# EAGLE schematic M8350 (EAGLE 6.6.0)
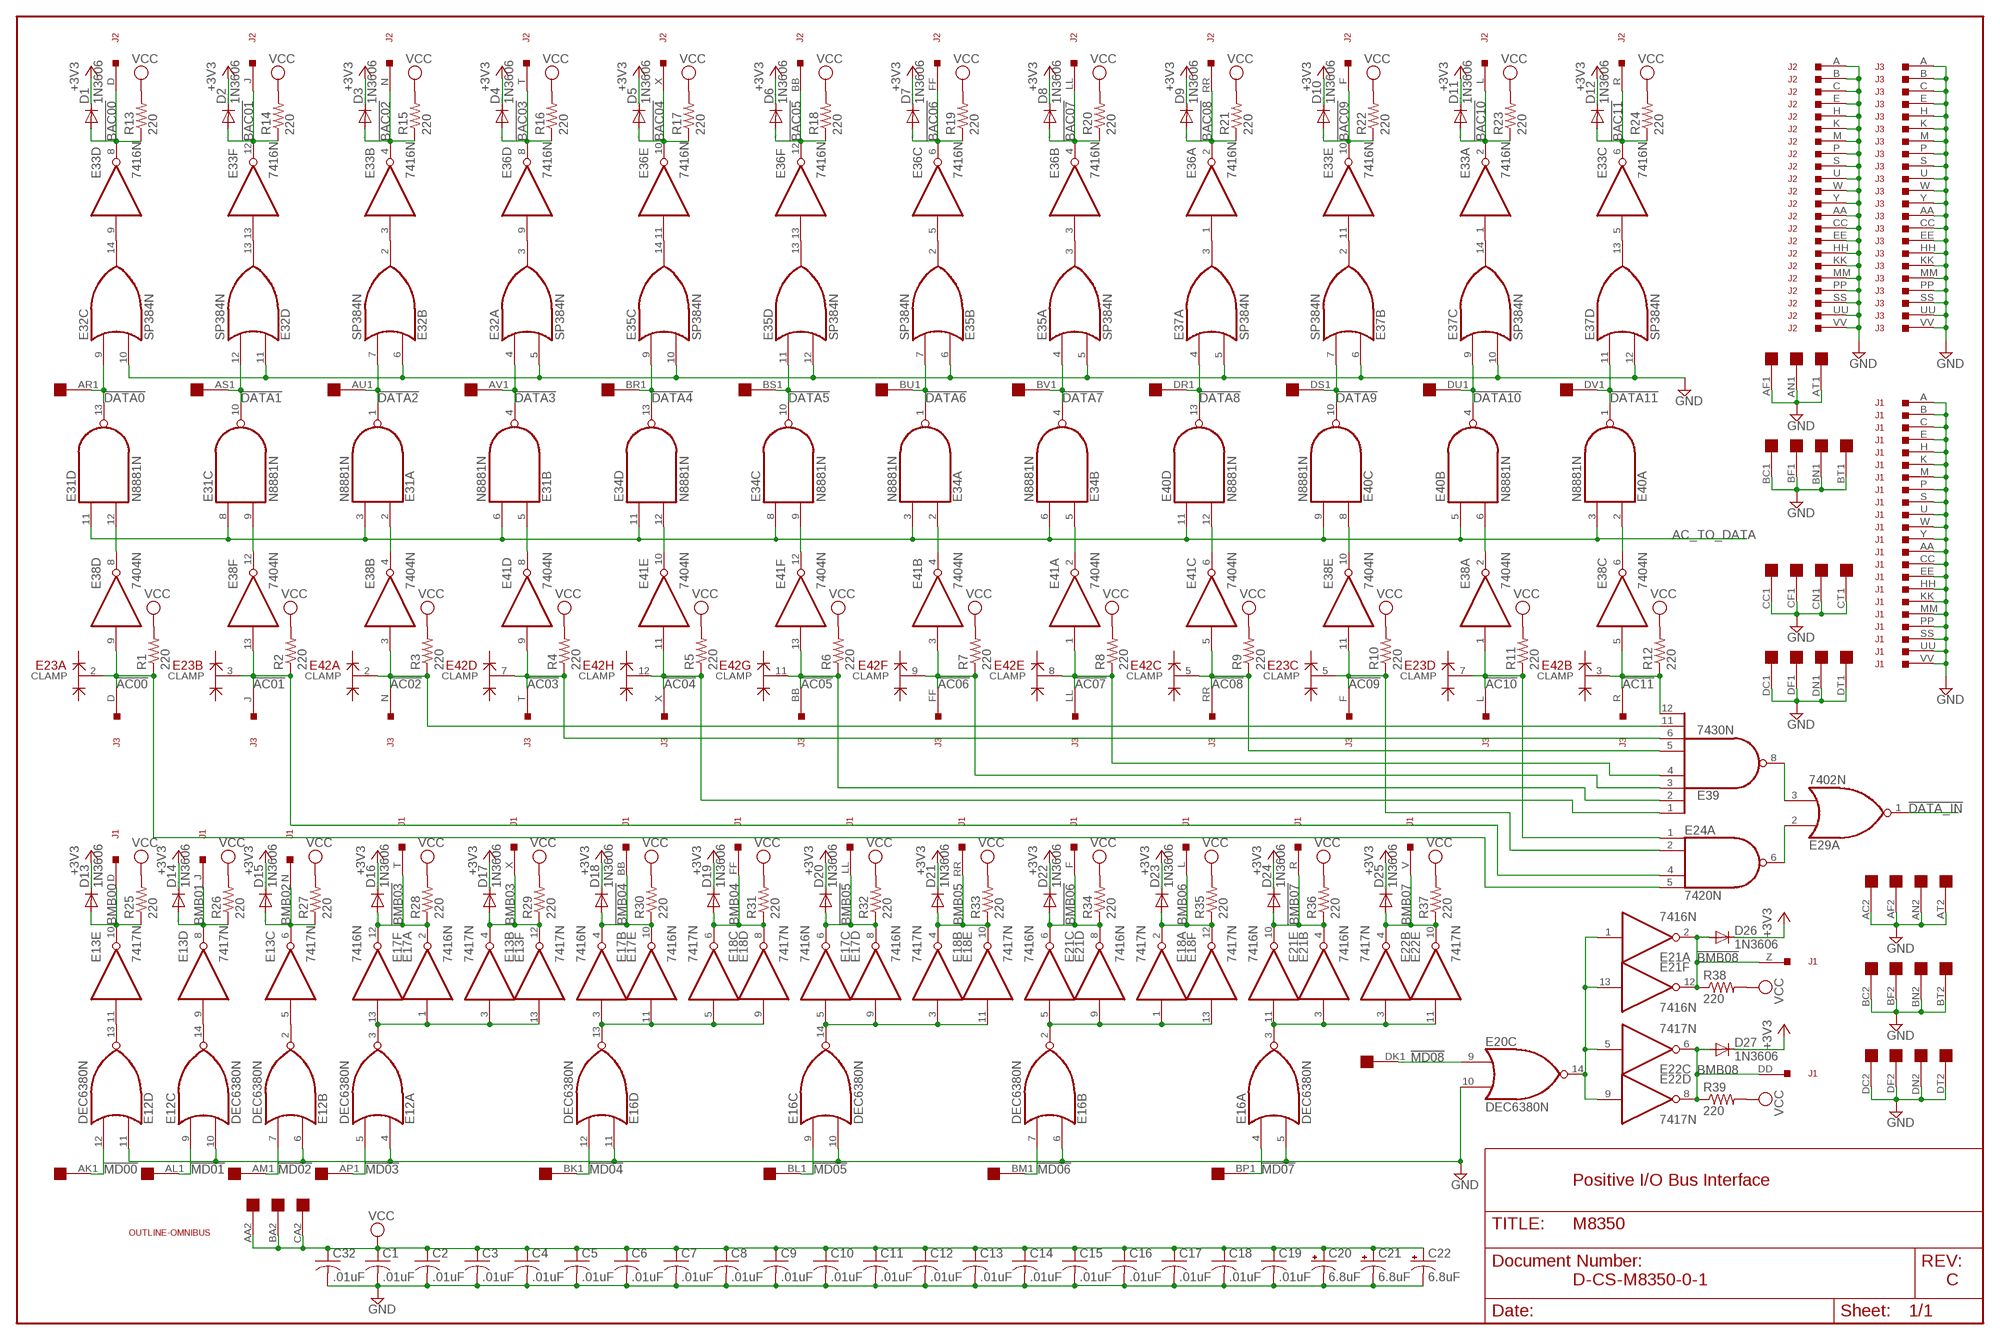
[diagram p0: schematic, sheet 1, part 1 of 2]
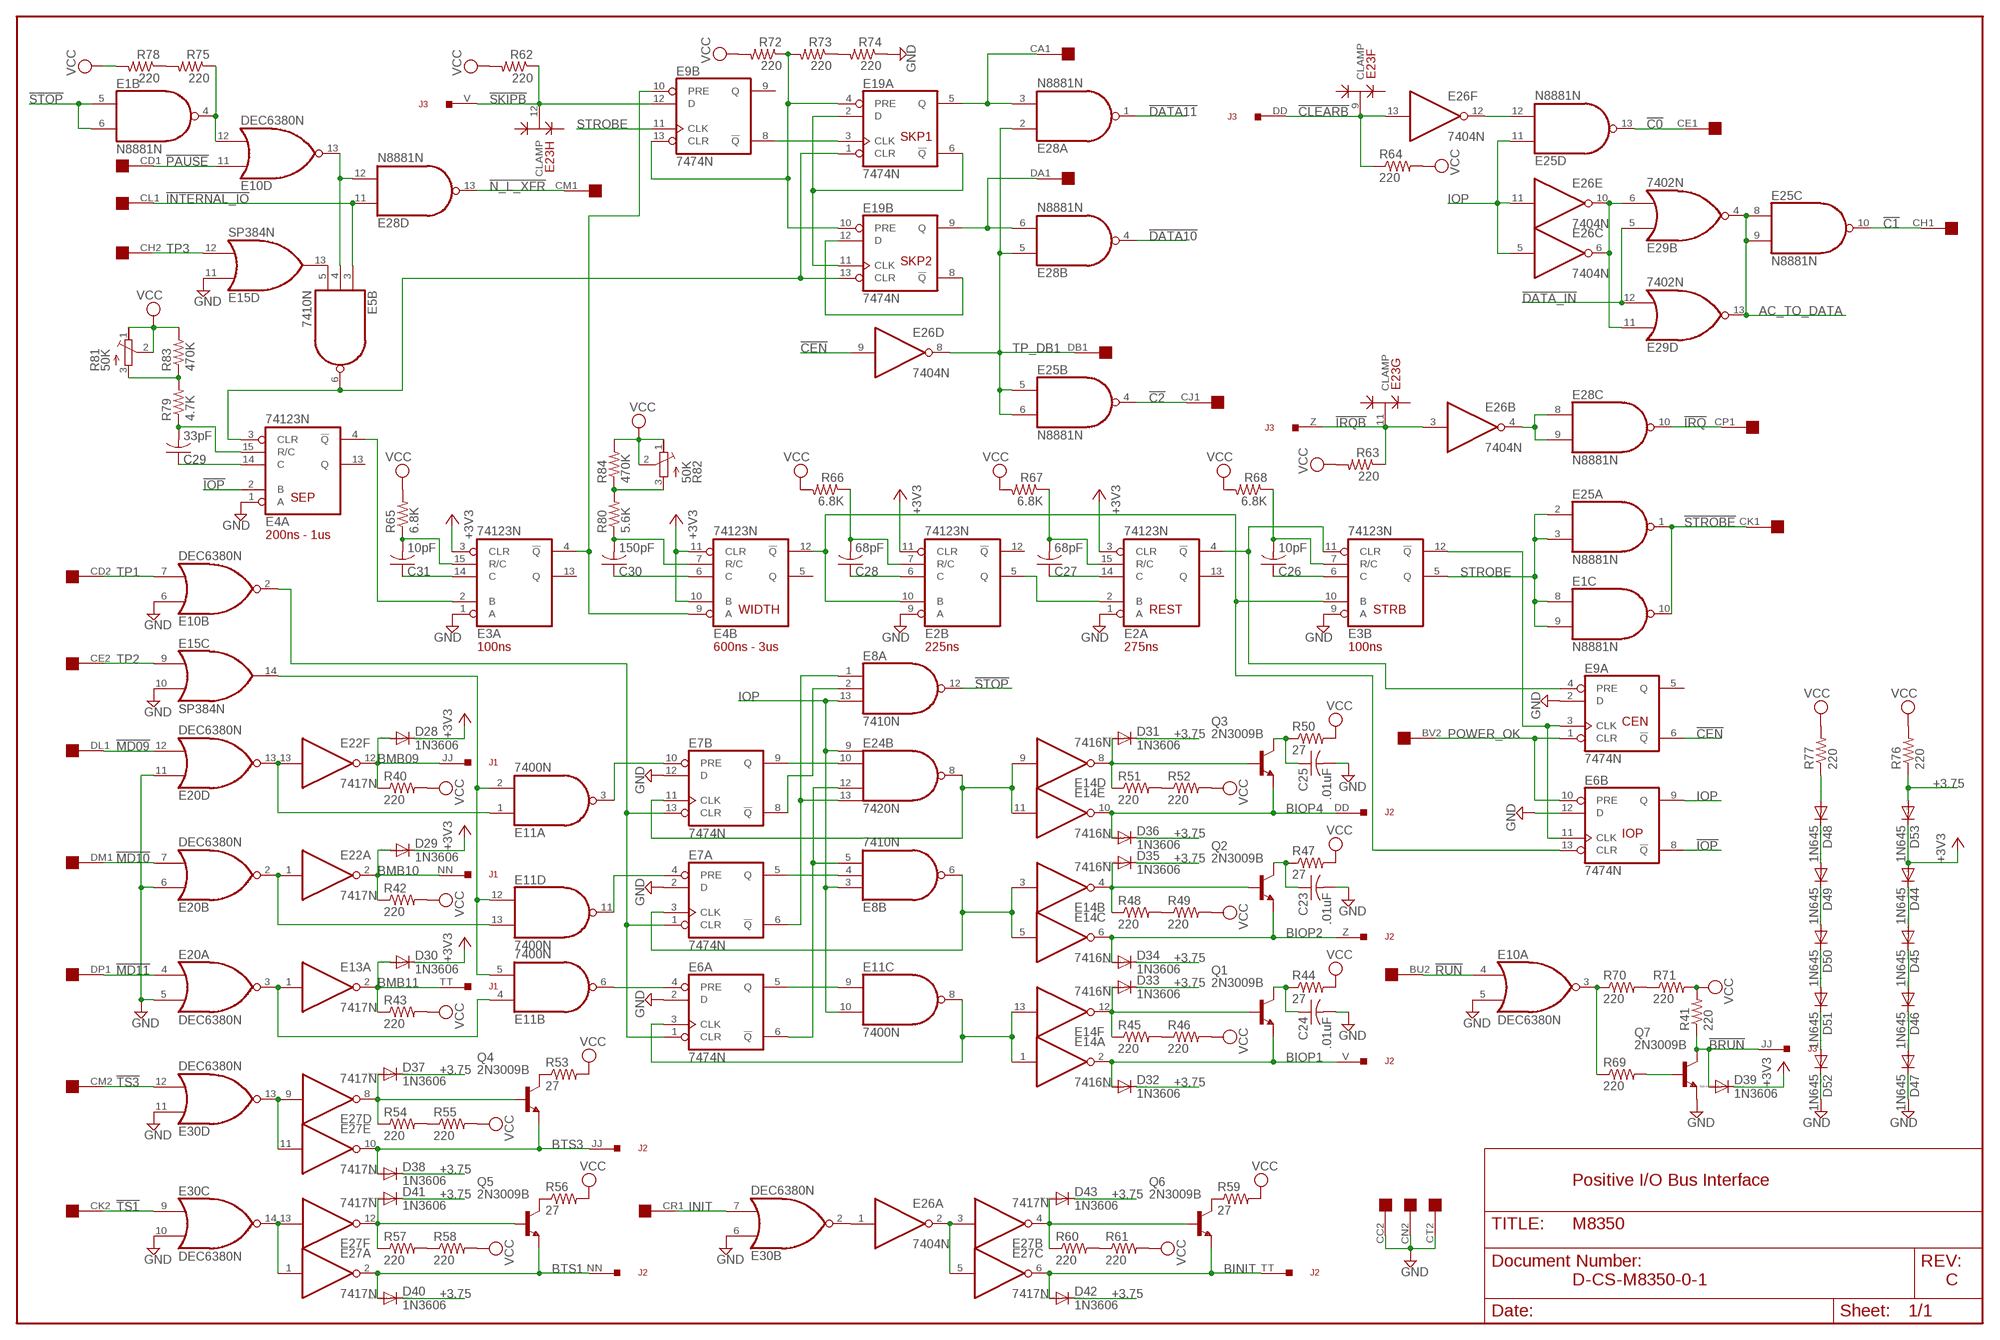
[diagram p1: schematic, sheet 1, part 2 of 2]

## Parts
C1  .01uF  C-US050-025X075  [C050-025X075]
C2  .01uF  C-US050-025X075  [C050-025X075]
C3  .01uF  C-US050-025X075  [C050-025X075]
C4  .01uF  C-US050-025X075  [C050-025X075]
C5  .01uF  C-US050-025X075  [C050-025X075]
C6  .01uF  C-US050-025X075  [C050-025X075]
C7  .01uF  C-US050-025X075  [C050-025X075]
C8  .01uF  C-US050-025X075  [C050-025X075]
C9  .01uF  C-US050-025X075  [C050-025X075]
C10  .01uF  C-US050-025X075  [C050-025X075]
C11  .01uF  C-US050-025X075  [C050-025X075]
C12  .01uF  C-US050-025X075  [C050-025X075]
C13  .01uF  C-US050-025X075  [C050-025X075]
C14  .01uF  C-US050-025X075  [C050-025X075]
C15  .01uF  C-US050-025X075  [C050-025X075]
C16  .01uF  C-US050-025X075  [C050-025X075]
C17  .01uF  C-US050-025X075  [C050-025X075]
C18  .01uF  C-US050-025X075  [C050-025X075]
C19  .01uF  C-US050-025X075  [C050-025X075]
C20  6.8uF  CPOL-USE20-8AXIAL  [E12-8]
C21  6.8uF  CPOL-USE20-8AXIAL  [E12-8]
C22  6.8uF  CPOL-USE20-8AXIAL  [E12-8]
C23  .01uF  C-US050-025X075  [C050-025X075]
C24  .01uF  C-US050-025X075  [C050-025X075]
C25  .01uF  C-US050-025X075  [C050-025X075]
C26  10pF  C-US050-025X075  [C050-025X075]
C27  68pF  C-US050-025X075  [C050-025X075]
C28  68pF  C-US050-025X075  [C050-025X075]
C29  33pF  C-US050-025X075  [C050-025X075]
C30  150pF  C-US050-025X075  [C050-025X075]
C31  10pF  C-US050-025X075  [C050-025X075]
C32  .01uF  C-US050-025X075  [C050-025X075]
D1  1N3606  DIODE-DO35-10  [DO35-10]
D2  1N3606  DIODE-DO35-10  [DO35-10]
D3  1N3606  DIODE-DO35-10  [DO35-10]
D4  1N3606  DIODE-DO35-10  [DO35-10]
D5  1N3606  DIODE-DO35-10  [DO35-10]
D6  1N3606  DIODE-DO35-10  [DO35-10]
D7  1N3606  DIODE-DO35-10  [DO35-10]
D8  1N3606  DIODE-DO35-10  [DO35-10]
D9  1N3606  DIODE-DO35-10  [DO35-10]
D10  1N3606  DIODE-DO35-10  [DO35-10]
D11  1N3606  DIODE-DO35-10  [DO35-10]
D12  1N3606  DIODE-DO35-10  [DO35-10]
D13  1N3606  DIODE-DO35-10  [DO35-10]
D14  1N3606  DIODE-DO35-10  [DO35-10]
D15  1N3606  DIODE-DO35-10  [DO35-10]
D16  1N3606  DIODE-DO35-10  [DO35-10]
D17  1N3606  DIODE-DO35-10  [DO35-10]
D18  1N3606  DIODE-DO35-10  [DO35-10]
D19  1N3606  DIODE-DO35-10  [DO35-10]
D20  1N3606  DIODE-DO35-10  [DO35-10]
D21  1N3606  DIODE-DO35-10  [DO35-10]
D22  1N3606  DIODE-DO35-10  [DO35-10]
D23  1N3606  DIODE-DO35-10  [DO35-10]
D24  1N3606  DIODE-DO35-10  [DO35-10]
D25  1N3606  DIODE-DO35-10  [DO35-10]
D26  1N3606  DIODE-DO35-10  [DO35-10]
D27  1N3606  DIODE-DO35-10  [DO35-10]
D28  1N3606  DIODE-DO35-10  [DO35-10]
D29  1N3606  DIODE-DO35-10  [DO35-10]
D30  1N3606  DIODE-DO35-10  [DO35-10]
D31  1N3606  DIODE-DO35-10  [DO35-10]
D32  1N3606  DIODE-DO35-10  [DO35-10]
D33  1N3606  DIODE-DO35-10  [DO35-10]
D34  1N3606  DIODE-DO35-10  [DO35-10]
D35  1N3606  DIODE-DO35-10  [DO35-10]
D36  1N3606  DIODE-DO35-10  [DO35-10]
D37  1N3606  DIODE-DO35-10  [DO35-10]
D38  1N3606  DIODE-DO35-10  [DO35-10]
D39  1N3606  DIODE-DO35-10  [DO35-10]
D40  1N3606  DIODE-DO35-10  [DO35-10]
D41  1N3606  DIODE-DO35-10  [DO35-10]
D42  1N3606  DIODE-DO35-10  [DO35-10]
D43  1N3606  DIODE-DO35-10  [DO35-10]
D44  1N645  DIODE-DO35-10  [DO35-10]
D45  1N645  DIODE-DO35-10  [DO35-10]
D46  1N645  DIODE-DO35-10  [DO35-10]
D47  1N645  DIODE-DO35-10  [DO35-10]
D48  1N645  DIODE-DO35-10  [DO35-10]
D49  1N645  DIODE-DO35-10  [DO35-10]
D50  1N645  DIODE-DO35-10  [DO35-10]
D51  1N645  DIODE-DO35-10  [DO35-10]
D52  1N645  DIODE-DO35-10  [DO35-10]
D53  1N645  DIODE-DO35-10  [DO35-10]
E1  N8881N  [DIL14]
E2  74123N  [DIL16]
E3  74123N  [DIL16]
E4  74123N  [DIL16]
E5  7410N  [DIL14]
E6  7474N  74S74N  [DIL14]
E7  7474N  74S74N  [DIL14]
E8  7410N  [DIL14]
E9  7474N  74S74N  [DIL14]
E10  DEC6380N  SP380N  [DIL14]
E11  7400N  [DIL14]
E12  DEC6380N  SP380N  [DIL14]
E13  7417N  [DIL14]
E14  7416N  [DIL14]
E15  SP384N  [DIL14]
E16  DEC6380N  SP380N  [DIL14]
E17  7416N  [DIL14]
E18  7417N  [DIL14]
E19  7474N  74S74N  [DIL14]
E20  DEC6380N  SP380N  [DIL14]
E21  7416N  [DIL14]
E22  7417N  [DIL14]
E23  DEC2501  [DIL14]
E24  7420N  74S20N  [DIL14]
E25  N8881N  [DIL14]
E26  7404N  [DIL14]
E27  7417N  [DIL14]
E28  N8881N  [DIL14]
E29  7402N  [DIL14]
E30  DEC6380N  SP380N  [DIL14]
E31  N8881N  [DIL14]
E32  SP384N  [DIL14]
E33  7416N  [DIL14]
E34  N8881N  [DIL14]
E35  SP384N  [DIL14]
E36  7416N  [DIL14]
E37  SP384N  [DIL14]
E38  7404N  [DIL14]
E39  7430N  [DIL14]
E40  N8881N  [DIL14]
E41  7404N  [DIL14]
E42  DEC2501  [DIL14]
J1  DEC40PINSH  [DEC40PINH]
J2  DEC40PINSH  [DEC40PINH]
J3  DEC40PINSH  [DEC40PINH]
Q1  2N3009B  -NPN-TO5  [TO5]
Q2  2N3009B  -NPN-TO5  [TO5]
Q3  2N3009B  -NPN-TO5  [TO5]
Q4  2N3009B  -NPN-TO5  [TO5]
Q5  2N3009B  -NPN-TO5  [TO5]
Q6  2N3009B  -NPN-TO5  [TO5]
Q7  2N3009B  -NPN-TO5  [TO5]
R1  220  R-US_0207/10  [0207/10]
R2  220  R-US_0207/10  [0207/10]
R3  220  R-US_0207/10  [0207/10]
R4  220  R-US_0207/10  [0207/10]
R5  220  R-US_0207/10  [0207/10]
R6  220  R-US_0207/10  [0207/10]
R7  220  R-US_0207/10  [0207/10]
R8  220  R-US_0207/10  [0207/10]
R9  220  R-US_0207/10  [0207/10]
R10  220  R-US_0207/10  [0207/10]
R11  220  R-US_0207/10  [0207/10]
R12  220  R-US_0207/10  [0207/10]
R13  220  R-US_0207/10  [0207/10]
R14  220  R-US_0207/10  [0207/10]
R15  220  R-US_0207/10  [0207/10]
R16  220  R-US_0207/10  [0207/10]
R17  220  R-US_0207/10  [0207/10]
R18  220  R-US_0207/10  [0207/10]
R19  220  R-US_0207/10  [0207/10]
R20  220  R-US_0207/10  [0207/10]
R21  220  R-US_0207/10  [0207/10]
R22  220  R-US_0207/10  [0207/10]
R23  220  R-US_0207/10  [0207/10]
R24  220  R-US_0207/10  [0207/10]
R25  220  R-US_0207/10  [0207/10]
R26  220  R-US_0207/10  [0207/10]
R27  220  R-US_0207/10  [0207/10]
R28  220  R-US_0207/10  [0207/10]
R29  220  R-US_0207/10  [0207/10]
R30  220  R-US_0207/10  [0207/10]
R31  220  R-US_0207/10  [0207/10]
R32  220  R-US_0207/10  [0207/10]
R33  220  R-US_0207/10  [0207/10]
R34  220  R-US_0207/10  [0207/10]
R35  220  R-US_0207/10  [0207/10]
R36  220  R-US_0207/10  [0207/10]
R37  220  R-US_0207/10  [0207/10]
R38  220  R-US_0207/10  [0207/10]
R39  220  R-US_0207/10  [0207/10]
R40  220  R-US_0207/10  [0207/10]
R41  220  R-US_0207/10  [0207/10]
R42  220  R-US_0207/10  [0207/10]
R43  220  R-US_0207/10  [0207/10]
R44  27  R-US_0207/10  [0207/10]
R45  220  R-US_0207/10  [0207/10]
R46  220  R-US_0207/10  [0207/10]
R47  27  R-US_0207/10  [0207/10]
R48  220  R-US_0207/10  [0207/10]
R49  220  R-US_0207/10  [0207/10]
R50  27  R-US_0207/10  [0207/10]
R51  220  R-US_0207/10  [0207/10]
R52  220  R-US_0207/10  [0207/10]
R53  27  R-US_0207/10  [0207/10]
R54  220  R-US_0207/10  [0207/10]
R55  220  R-US_0207/10  [0207/10]
R56  27  R-US_0207/10  [0207/10]
R57  220  R-US_0207/10  [0207/10]
R58  220  R-US_0207/10  [0207/10]
R59  27  R-US_0207/10  [0207/10]
R60  220  R-US_0207/10  [0207/10]
R61  220  R-US_0207/10  [0207/10]
R62  220  R-US_0207/10  [0207/10]
R63  220  R-US_0207/10  [0207/10]
R64  220  R-US_0207/10  [0207/10]
R65  6.8K  R-US_0207/10  [0207/10]
R66  6.8K  R-US_0207/10  [0207/10]
R67  6.8K  R-US_0207/10  [0207/10]
R68  6.8K  R-US_0207/10  [0207/10]
R69  220  R-US_0207/10  [0207/10]
R70  220  R-US_0207/10  [0207/10]
R71  220  R-US_0207/10  [0207/10]
R72  220  R-US_0207/10  [0207/10]
R73  220  R-US_0207/10  [0207/10]
R74  220  R-US_0207/10  [0207/10]
R75  220  R-US_0207/10  [0207/10]
R76  220  R-US_0207/10  [0207/10]
R77  220  R-US_0207/10  [0207/10]
R78  220  R-US_0207/10  [0207/10]
R79  4.7K  R-US_0207/10  [0207/10]
R80  5.6K  R-US_0207/10  [0207/10]
R81  50K  275P  [3006Y]
R82  50K  275P  [3006Y]
R83  470K  R-US_0207/10  [0207/10]
R84  470K  R-US_0207/10  [0207/10]
U$1  OUTLINE-OMNIBUS  [OMNIBUS]
U$2  QUAD  [EDGE-CON8]

## Nets
!AC00: E23.2(A:CLAMP) E24.5(A:I3) E38.9(D:I) J3.D R1.1
!AC01: E23.3(B:CLAMP) E24.4(A:I2) E38.13(F:I) J3.J R2.1
!AC02: E38.3(B:I) E39.11(I6) E42.2(A:CLAMP) J3.N R3.1
!AC03: E39.6(I5) E41.9(D:I) E42.7(D:CLAMP) J3.T R4.1
!AC04: E39.1(I0) E41.11(E:I) E42.12(H:CLAMP) J3.X R5.1
!AC05: E39.2(I1) E41.13(F:I) E42.11(G:CLAMP) J3.BB R6.1
!AC06: E39.3(I2) E41.3(B:I) E42.9(F:CLAMP) J3.FF R7.1
!AC07: E39.4(I3) E41.1(A:I) E42.8(E:CLAMP) J3.LL R8.1
!AC08: E39.5(I4) E41.5(C:I) E42.5(C:CLAMP) J3.RR R9.1
!AC09: E23.5(C:CLAMP) E24.2(A:I1) E38.11(E:I) J3.F R10.1
!AC10: E23.7(D:CLAMP) E24.1(A:I0) E38.1(A:I) J3.L R11.1
!AC11: E38.5(C:I) E39.12(I7) E42.3(B:CLAMP) J3.R R12.1
!BAC00: D1.A E33.8(D:O) J2.D R13.1
!BAC01: D2.A E33.12(F:O) J2.J R14.1
!BAC02: D3.A E33.4(B:O) J2.N R15.1
!BAC03: D4.A E36.8(D:O) J2.T R16.1
!BAC04: D5.A E36.10(E:O) J2.X R17.1
!BAC05: D6.A E36.12(F:O) J2.BB R18.1
!BAC06: D7.A E36.6(C:O) J2.FF R19.1
!BAC07: D8.A E36.4(B:O) J2.LL R20.1
!BAC08: D9.A E36.2(A:O) J2.RR R21.1
!BAC09: D10.A E33.10(E:O) J2.F R22.1
!BAC10: D11.A E33.2(A:O) J2.L R23.1
!BAC11: D12.A E33.6(C:O) J2.R R24.1
!BMB03: D16.A E17.2(A:O) E17.12(F:O) J1.T R28.1
!BMB04: D18.A E17.4(B:O) E17.10(E:O) J1.BB R30.1
!BMB05: D20.A E17.6(C:O) E17.8(D:O) J1.LL R32.1
!BMB06: D22.A E21.6(C:O) E21.8(D:O) J1.F R34.1
!BMB07: D24.A E21.4(B:O) E21.10(E:O) J1.R R36.1
!BMB08: D26.A E21.2(A:O) E21.12(F:O) J1.Z R38.1
!BRUN: D39.A J3.JJ Q7.3(C) R41.1
!C0: E25.13(D:O) U$2.CE1
!C1: E25.10(C:O) U$2.CH1
!C2: E25.4(B:O) U$2.CJ1
!CEN: E9.6(A:!Q) E26.9(D:I)
!CLEARB: E23.9(F:CLAMP) E26.13(F:I) J3.DD R64.1
!DATA0: E31.13(D:O) E32.9(C:I0) U$2.AR1
!DATA1: E31.10(C:O) E32.12(D:I1) U$2.AS1
!DATA2: E31.1(A:O) E32.7(B:I1) U$2.AU1
!DATA3: E31.4(B:O) E32.4(A:I0) U$2.AV1
!DATA4: E34.13(D:O) E35.9(C:I0) U$2.BR1
!DATA5: E34.10(C:O) E35.11(D:I0) U$2.BS1
!DATA6: E34.1(A:O) E35.7(B:I1) U$2.BU1
!DATA7: E34.4(B:O) E35.4(A:I0) U$2.BV1
!DATA8: E37.4(A:I0) E40.13(D:O) U$2.DR1
!DATA9: E37.7(B:I1) E40.10(C:O) U$2.DS1
!DATA10: E28.4(B:O) E37.9(C:I0) E40.4(B:O) U$2.DU1
!DATA11: E28.1(A:O) E37.11(D:I0) E40.1(A:O) U$2.DV1
!DATA_IN: E29.1(A:O) E29.5(B:I0) E29.12(D:I1)
!INTERNAL_IO: E5.3(B:I0) E28.11(D:I0) U$2.CL1
!IOP: E4.2(A:B) E6.8(B:!Q)
!IRQ: E28.10(C:O) U$2.CP1
!IRQB: E23.11(G:CLAMP) E26.3(B:I) J3.Z R63.1
!MD00: E12.12(D:I1) U$2.AK1
!MD01: E12.9(C:I0) U$2.AL1
!MD02: E12.7(B:I1) U$2.AM1
!MD03: E12.5(A:I1) U$2.AP1
!MD04: E16.12(D:I1) U$2.BK1
!MD05: E16.9(C:I0) U$2.BL1
!MD06: E16.7(B:I1) U$2.BM1
!MD07: E16.4(A:I0) U$2.BP1
!MD08: E20.9(C:I0) U$2.DK1
!MD09: E20.12(D:I1) U$2.DL1
!MD10: E20.7(B:I1) U$2.DM1
!MD11: E20.4(A:I0) U$2.DP1
!N_L_XFR: E28.13(D:O) U$2.CM1
!PAUSE: E10.11(D:I0) U$2.CD1
!RUN: E10.4(A:I0) U$2.BU2
!SKIPB: E9.12(B:D) E23.12(H:CLAMP) J3.V R62.1
!STOP: E1.5(B:I0) E1.6(B:I1) E8.12(A:O)
!STROBE: E1.10(C:O) E25.1(A:O) U$2.CK1
!TS1: E30.9(C:I0) U$2.CK2
!TS3: E30.12(D:I1) U$2.CM2
+3.75: D31.C D32.C D33.C D34.C D35.C D36.C D37.C D38.C D40.C D41.C D42.C D43.C D53.A R76.1
+3V3: D1.C D2.C D3.C D4.C D5.C D6.C D7.C D8.C D9.C D10.C D11.C D12.C D13.C D14.C D15.C D16.C D17.C D18.C D19.C D20.C D21.C D22.C D23.C D24.C D25.C D26.C D27.C D28.C D29.C D30.C D39.C D44.A D53.C E2.3(A:CLR) E2.11(B:CLR) E3.3(A:CLR) E4.10(B:B) E4.11(B:CLR)
AC_TO_DATA: E25.8(C:I0) E25.9(C:I1) E29.4(B:O) E29.13(D:O) E31.3(A:I1) E31.6(B:I1) E31.8(C:I0) E31.11(D:I0) E34.3(A:I1) E34.6(B:I1) E34.8(C:I0) E34.11(D:I0) E40.3(A:I1) E40.5(B:I0) E40.9(C:I1) E40.11(D:I0)
BINIT: D42.A E27.6(C:O) J2.TT Q6.1(E)
BIOP1: D32.A E14.2(A:O) J2.V Q1.1(E)
BIOP2: D34.A E14.6(C:O) J2.Z Q2.1(E)
BIOP4: D36.A E14.10(E:O) J2.DD Q3.1(E)
BMB00: D13.A E13.10(E:O) J1.D R25.1
BMB01: D14.A E13.8(D:O) J1.J R26.1
BMB02: D15.A E13.6(C:O) J1.N R27.1
BMB03: D17.A E13.4(B:O) E13.12(F:O) J1.X R29.1
BMB04: D19.A E18.6(C:O) E18.8(D:O) J1.FF R31.1
BMB05: D21.A E18.4(B:O) E18.10(E:O) J1.RR R33.1
BMB06: D23.A E18.2(A:O) E18.12(F:O) J1.L R35.1
BMB07: D25.A E22.4(B:O) E22.10(E:O) J1.V R37.1
BMB08: D27.A E22.6(C:O) E22.8(D:O) J1.DD R39.1
BMB09: D28.A E22.12(F:O) J1.JJ R40.1
BMB10: D29.A E22.2(A:O) J1.NN R42.1
BMB11: D30.A E13.2(A:O) J1.TT R43.1
BTS1: D40.A E27.2(A:O) J2.NN Q5.1(E)
BTS3: D38.A E27.10(E:O) J2.JJ Q4.1(E)
GND: C1.2 C2.2 C3.2 C4.2 C5.2 C6.2 C7.2 C8.2 C9.2 C10.2 C11.2 C12.2 C13.2 C14.2 C15.2 C16.2 C17.2 C18.2 C19.2 C20.- C21.- C22.- C23.2 C24.2 C25.2 C32.2 D47.C D52.C E2.1(A:A) E2.9(B:A) E3.1(A:A) E3.9(B:A) E4.1(A:A) E6.2(A:D) E6.12(B:D) E7.2(A:D) E7.12(B:D) E9.2(A:D) E10.5(A:I1) E10.6(B:I0) E12.4(A:I0) E12.6(B:I0) E12.10(C:I1) E12.11(D:I0) E15.10(C:I1) E15.11(D:I0) E16.5(A:I1) E16.6(B:I0) E16.10(C:I1) E16.11(D:I0) E20.5(A:I1) E20.6(B:I0) E20.10(C:I1) E20.11(D:I0) E30.6(B:I0) E30.10(C:I1) E30.11(D:I0) E32.5(A:I1) E32.6(B:I0) E32.10(C:I1) E32.11(D:I0) E35.5(A:I1) E35.6(B:I0) E35.10(C:I1) E35.12(D:I1) E37.5(A:I1) E37.6(B:I0) E37.10(C:I1) E37.12(D:I1) J1.A J1.AA J1.B J1.C J1.CC J1.E J1.EE J1.H J1.HH J1.K J1.KK J1.M J1.MM J1.P J1.PP J1.S J1.SS J1.U J1.UU J1.VV J1.W J1.Y J2.A J2.AA J2.B J2.C J2.CC J2.E J2.EE J2.H J2.HH J2.K J2.KK J2.M J2.MM J2.P J2.PP J2.S J2.SS J2.U J2.UU J2.VV J2.W J2.Y J3.A J3.AA J3.B J3.C J3.CC J3.E J3.EE J3.H J3.HH J3.K J3.KK J3.M J3.MM J3.P J3.PP J3.S J3.SS J3.U J3.UU J3.VV J3.W J3.Y Q7.1(E) R74.1 U$2.AC2 U$2.AF1 U$2.AF2 U$2.AN1 U$2.AN2 U$2.AT1 U$2.AT2 U$2.BC1 U$2.BC2 U$2.BF1 U$2.BF2 U$2.BN1 U$2.BN2 U$2.BT1 U$2.BT2 U$2.CC1 U$2.CC2 U$2.CF1 U$2.CN1 U$2.CN2 U$2.CT1 U$2.CT2 U$2.DC1 U$2.DC2 U$2.DF1 U$2.DF2 U$2.DN1 U$2.DN2 U$2.DT1 U$2.DT2
INIT: E30.7(B:I1) U$2.CR1
IOP: E6.9(B:Q) E8.3(B:I0) E8.13(A:I2) E11.10(C:I1) E24.9(B:I0) E25.11(D:I0) E26.5(C:I) E26.11(E:I)
N$1: E32.14(C:O) E33.9(D:I)
N$2: E31.2(A:I0) E38.4(B:O)
N$3: E34.12(D:I1) E41.10(E:O)
N$4: E31.12(D:I1) E38.8(D:O)
N$5: E31.9(C:I1) E38.12(F:O)
N$6: E16.13(D:O) E17.3(B:I) E17.11(E:I) E18.5(C:I) E18.9(D:I)
N$8: E34.9(C:I1) E41.12(F:O)
N$9: E34.2(A:I0) E41.4(B:O)
N$10: E34.5(B:I0) E41.2(A:O)
N$11: E40.12(D:I1) E41.6(C:O)
N$12: E38.6(C:O) E40.2(A:I0)
N$13: E38.10(E:O) E40.8(C:I0)
N$14: E38.2(A:O) E40.6(B:I1)
N$15: E24.6(A:O) E29.2(A:I0)
N$16: E29.3(A:I1) E39.8(O)
N$17: E32.2(B:O) E33.3(B:I)
N$18: E32.13(D:O) E33.13(F:I)
N$19: E31.5(B:I0) E41.8(D:O)
N$20: E32.3(A:O) E36.9(D:I)
N$21: E35.14(C:O) E36.11(E:I)
N$22: E35.13(D:O) E36.13(F:I)
N$23: E35.2(B:O) E36.5(C:I)
N$24: E35.3(A:O) E36.3(B:I)
N$25: E36.1(A:I) E37.3(A:O)
N$26: E33.11(E:I) E37.2(B:O)
N$27: E33.1(A:I) E37.14(C:O)
N$28: E33.5(C:I) E37.13(D:O)
N$40: E12.13(D:O) E13.11(E:I)
N$41: E16.14(C:O) E17.5(C:I) E17.9(D:I) E18.3(B:I) E18.11(E:I)
N$43: E16.3(A:O) E21.3(B:I) E21.11(E:I) E22.3(B:I) E22.11(E:I)
N$44: E20.14(C:O) E21.1(A:I) E21.13(F:I) E22.5(C:I) E22.9(D:I)
N$45: E12.14(C:O) E13.9(D:I)
N$46: E16.2(B:O) E18.1(A:I) E18.13(F:I) E21.5(C:I) E21.9(D:I)
N$47: E11.4(B:I0) E13.1(A:I) E20.3(A:O)
N$48: E11.1(A:I0) E20.13(D:O) E22.13(F:I)
N$49: E12.2(B:O) E13.5(C:I)
N$50: E12.3(A:O) E13.3(B:I) E13.13(F:I) E17.1(A:I) E17.13(F:I)
N$51: E11.13(D:I1) E20.2(B:O) E22.1(A:I)
N$52: R54.2 R55.1
N$53: E3.2(A:B) E4.4(A:!Q)
N$54: E27.9(D:I) E27.11(E:I) E30.13(D:O)
N$55: D37.A E27.8(D:O) Q4.2(B) R54.1
N$56: Q4.3(C) R53.1
N$57: E3.4(A:!Q) E4.9(B:A) E9.10(B:PRE)
N$58: D41.A E27.12(F:O) Q5.2(B) R57.1
N$59: E2.10(B:B) E3.10(B:B) E4.12(B:!Q) E6.13(B:CLR)
N$60: E27.1(A:I) E27.13(F:I) E30.14(C:O)
N$61: R57.2 R58.1
N$62: E2.2(A:B) E2.5(B:Q)
N$63: Q5.3(C) R56.1
N$64: E2.4(A:!Q) E3.11(B:CLR) E9.4(A:PRE)
N$65: E26.1(A:I) E30.2(B:O)
N$66: E26.2(A:O) E27.3(B:I) E27.5(C:I)
N$67: R60.2 R61.1
N$68: D43.A E27.4(B:O) Q6.2(B) R60.1
N$69: Q6.3(C) R59.1
N$70: R80.2 R82.3(E) R84.1
N$71: C29.2 E4.15(A:R/C) R79.1
N$72: C29.1 E4.14(A:C)
N$73: E11.2(A:I1) E11.5(B:I1) E11.12(D:I0) E15.14(C:O)
N$74: R79.2 R81.3(E) R83.1
N$75: C31.1 E3.14(A:C)
N$76: C31.2 E3.15(A:R/C) R65.1
N$77: C30.1 E4.6(B:C)
N$78: C30.2 E4.7(B:R/C) R80.1
N$79: C28.1 E2.6(B:C)
N$80: C28.2 E2.7(B:R/C) R66.1
N$81: C27.1 E2.14(A:C)
N$82: C27.2 E2.15(A:R/C) R67.1
N$83: C26.1 E3.6(B:C)
N$84: C26.2 E3.7(B:R/C) R68.1
N$85: E7.10(B:PRE) E11.3(A:O)
N$86: E7.4(A:PRE) E11.11(D:O)
N$87: E6.4(A:PRE) E11.6(B:O)
N$88: E6.1(A:CLR) E7.1(A:CLR) E7.13(B:CLR) E10.2(B:O)
N$89: E6.5(A:Q) E11.9(C:I0)
N$90: E7.5(A:Q) E8.4(B:I1)
N$92: E7.9(B:Q) E24.10(B:I1)
N$93: E6.6(A:!Q) E8.5(B:I2) E24.12(B:I2)
N$94: E7.6(A:!Q) E8.1(A:I0) E24.13(B:I3)
N$95: E7.8(B:!Q) E8.2(A:I1)
N$96: E7.3(A:CLK) E8.6(B:O) E14.3(B:I) E14.5(C:I)
N$97: E6.3(A:CLK) E11.8(C:O) E14.1(A:I) E14.13(F:I)
N$98: E7.11(B:CLK) E14.9(D:I) E14.11(E:I) E24.8(B:O)
N$99: D48.A R77.1
N$100: D44.C D45.A
N$101: D45.C D46.A
N$102: D46.C D47.A
N$104: D48.C D49.A
N$105: D51.C D52.A
N$106: D50.C D51.A
N$107: D49.C D50.A
N$108: D35.A E14.4(B:O) Q2.2(B) R48.1
N$109: D33.A E14.12(F:O) Q1.2(B) R45.1
N$110: R48.2 R49.1
N$111: R51.2 R52.1
N$112: D31.A E14.8(D:O) Q3.2(B) R51.1
N$113: C25.1 Q3.3(C) R50.1
N$114: E10.3(A:O) R69.1 R70.1
N$115: R70.2 R71.1
N$116: C23.1 Q2.3(C) R47.1
N$117: Q7.2(B) R69.2
N$118: C24.1 Q1.3(C) R44.1
N$119: R45.2 R46.1
N$120: R73.1 R74.2
N$121: E9.13(B:CLR) E19.4(A:PRE) E19.10(B:PRE) R72.1 R73.2
N$122: R75.2 R78.1
N$123: E26.6(C:O) E26.10(E:O) E29.6(B:I1) E29.11(D:I0)
N$126: E25.12(D:I1) E26.12(F:O)
N$128: E26.4(B:O) E28.8(C:I0) E28.9(C:I1)
N$130: E5.5(B:I2) E15.13(D:O)
N$131: E5.4(B:I1) E10.13(D:O) E28.12(D:I1)
N$134: E4.3(A:CLR) E5.6(B:O) E19.1(A:CLR) E19.13(B:CLR)
N$135: E19.2(A:D) E19.6(A:!Q) E19.11(B:CLK)
N$136: E1.4(B:O) E10.12(D:I1) R75.1
N$138: E9.8(B:!Q) E19.3(A:CLK)
N$140: E19.8(B:!Q) E19.12(B:D)
N$141: E3.12(B:!Q) E6.11(B:CLK) E9.3(A:CLK)
POWER_OK: E6.10(B:PRE) E9.1(A:CLR) U$2.BV2
SKP1: E19.5(A:Q) E28.3(A:I1) U$2.CA1
SKP2: E19.9(B:Q) E28.6(B:I1) U$2.DA1
STROBE: E1.8(C:I0) E1.9(C:I1) E3.5(B:Q) E9.11(B:CLK) E25.2(A:I0) E25.3(A:I1)
TP1: E10.7(B:I1) U$2.CD2
TP2: E15.9(C:I0) U$2.CE2
TP3: E15.12(D:I1) U$2.CH2
TP_DB1: E25.5(B:I0) E25.6(B:I1) E26.8(D:O) E28.2(A:I0) E28.5(B:I0) U$2.DB1
VCC: C1.1 C2.1 C3.1 C4.1 C5.1 C6.1 C7.1 C8.1 C9.1 C10.1 C11.1 C12.1 C13.1 C14.1 C15.1 C16.1 C17.1 C18.1 C19.1 C20.+ C21.+ C22.+ C32.1 R1.2 R2.2 R3.2 R4.2 R5.2 R6.2 R7.2 R8.2 R9.2 R10.2 R11.2 R12.2 R13.2 R14.2 R15.2 R16.2 R17.2 R18.2 R19.2 R20.2 R21.2 R22.2 R23.2 R24.2 R25.2 R26.2 R27.2 R28.2 R29.2 R30.2 R31.2 R32.2 R33.2 R34.2 R35.2 R36.2 R37.2 R38.2 R39.2 R40.2 R41.2 R42.2 R43.2 R44.2 R46.2 R47.2 R49.2 R50.2 R52.2 R53.2 R55.2 R56.2 R58.2 R59.2 R61.2 R62.2 R63.2 R64.2 R65.2 R66.2 R67.2 R68.2 R71.2 R72.2 R76.2 R77.2 R78.2 R81.1(A) R81.2(S) R82.1(A) R82.2(S) R83.2 R84.2 U$2.AA2 U$2.BA2 U$2.CA2
Unconnected: E1.1(A:O) E1.2(A:I0) E1.3(A:I1) E1.11(D:I0) E1.12(D:I1) E1.13(D:O) E2.12(B:!Q) E2.13(A:Q) E3.13(A:Q) E4.5(B:Q) E4.13(A:Q) E5.1(A:I0) E5.2(A:I1) E5.8(C:O) E5.9(C:I0) E5.10(C:I1) E5.11(C:I2) E5.12(A:O) E5.13(A:I2) E8.8(C:O) E8.9(C:I0) E8.10(C:I1) E8.11(C:I2) E9.5(A:Q) E9.9(B:Q) E10.9(C:I0) E10.10(C:I1) E10.14(C:O) E15.2(B:O) E15.3(A:O) E15.4(A:I0) E15.5(A:I1) E15.6(B:I0) E15.7(B:I1) E23.8(E:CLAMP) E29.8(C:I0) E29.9(C:I1) E29.10(C:O) E30.3(A:O) E30.4(A:I0) E30.5(A:I1) J3.NN J3.TT U$2.AA1 U$2.AB1 U$2.AB2 U$2.AC1 U$2.AD1 U$2.AD2 U$2.AE1 U$2.AE2 U$2.AH1 U$2.AH2 U$2.AJ1 U$2.AJ2 U$2.AK2 U$2.AL2 U$2.AM2 U$2.AP2 U$2.AR2 U$2.AS2 U$2.AU2 U$2.AV2 U$2.BA1 U$2.BB1 U$2.BB2 U$2.BD1 U$2.BD2 U$2.BE1 U$2.BE2 U$2.BH1 U$2.BH2 U$2.BJ1 U$2.BJ2 U$2.BK2 U$2.BL2 U$2.BM2 U$2.BP2 U$2.BR2 U$2.BS2 U$2.CB1 U$2.CB2 U$2.CF2 U$2.CJ2 U$2.CL2 U$2.CP2 U$2.CR2 U$2.CS1 U$2.CS2 U$2.CU1 U$2.CU2 U$2.CV1 U$2.CV2 U$2.DA2 U$2.DB2 U$2.DD1 U$2.DD2 U$2.DE1 U$2.DE2 U$2.DH1 U$2.DH2 U$2.DJ1 U$2.DJ2 U$2.DK2 U$2.DL2 U$2.DM2 U$2.DP2 U$2.DR2 U$2.DS2 U$2.DU2 U$2.DV2

## Notes on the sheet
- SKP1
- SKP2
- SEP
- 200ns - 1us
- WIDTH | REST | STRB
- 100ns | 600ns - 3us | 225ns | 275ns | 100ns
- CEN
- IOP
- Positive I/O Bus Interface | Positive I/O Bus Interface
- D-CS-M8350-0-1 | C | D-CS-M8350-0-1 | C

## Power pins joined to a net without a drawn wire
GND: E1.7(P:GND) E2.8(P:GND) E3.8(P:GND) E4.8(P:GND) E5.7(P:GND) E6.7(P:GND) E7.7(P:GND) E8.7(P:GND) E9.7(P:GND) E10.1(P:GND) E11.7(P:GND) E12.1(P:GND) E13.7(P:GND) E14.7(P:GND) E15.1(GND) E16.1(P:GND) E17.7(P:GND) E18.7(P:GND) E19.7(P:GND) E20.1(P:GND) E21.7(P:GND) E22.7(P:GND) E23.14(PWR:GND) E24.7(P:GND) E25.7(P:GND) E26.7(P:GND) E27.7(P:GND) E28.7(P:GND) E29.7(P:GND) E30.1(P:GND) E31.7(P:GND) E32.1(GND) E33.7(P:GND) E34.7(P:GND) E35.1(GND) E36.7(P:GND) E37.1(GND) E38.7(P:GND) E39.7(GND) E40.7(P:GND) E41.7(P:GND) E42.14(PWR:GND)
VCC: E1.14(P:VCC) E2.16(P:VCC) E3.16(P:VCC) E4.16(P:VCC) E5.14(P:VCC) E6.14(P:VCC) E7.14(P:VCC) E8.14(P:VCC) E9.14(P:VCC) E10.8(P:VCC) E11.14(P:VCC) E12.8(P:VCC) E13.14(P:VCC) E14.14(P:VCC) E15.8(VCC) E16.8(P:VCC) E17.14(P:VCC) E18.14(P:VCC) E19.14(P:VCC) E20.8(P:VCC) E21.14(P:VCC) E22.14(P:VCC) E23.1(PWR:VCC) E24.14(P:VCC) E25.14(P:VCC) E26.14(P:VCC) E27.14(P:VCC) E28.14(P:VCC) E29.14(P:VCC) E30.8(P:VCC) E31.14(P:VCC) E32.8(VCC) E33.14(P:VCC) E34.14(P:VCC) E35.8(VCC) E36.14(P:VCC) E37.8(VCC) E38.14(P:VCC) E39.14(VCC) E40.14(P:VCC) E41.14(P:VCC) E42.1(PWR:VCC)

## Library data of the parts
C1-C19 C23-C32 = rcl:C-US: CAPACITOR, American symbol
C20-C22 = dec-con:CPOL-USE20-8AXIAL: A 0.8 inch electrolytic.
D1-D53 = diode:DIODE-: DIODE
E1 E25 E28 E31 E34 E40 = dec-con:N8881: Quad 2-input NAND gate, open collector
E2-E4 = 74xx-us:74*123: Retriggerable monostable MULTIVIBRATOR
E5 E8 = 74xx-us:74*10: Triple 3-input NAND gate
E6 E7 E9 E19 = 74xx-us:74*74: Dual D type positive edge triggered FLIP FLOP, preset and clear
E10 E12 E16 E20 E30 = dec-con:SP380: Quad NOR gate (use 8640)
E11 = 74xx-us:74*00: Quad 2-input NAND gate
E13 E18 E22 E27 = 74xx-us:74*17: Hex INVERTER, open collector, high-voltage
E14 E17 E21 E33 E36 = 74xx-us:74*16: Hex INVERTER, open collector, high-voltage
E15 E32 E35 E37 = dec-con:SP384: Quad OR gate
E23 E42 = dec-con:DEC2501: Diode Pack (Clamps)
E24 = 74xx-us:74*20: Dual 4-input NAND gate
E26 E38 E41 = 74xx-us:74*04: Hex INVERTER
E29 = 74xx-us:74*02: Quad 2-input NOR gate
E39 = 74xx-us:74*30: 8-input NAND gate
J1-J3 = dec-con:DEC40PINS: 40 pin ribbon connector for BC08, BC11 cables.
Q1-Q7 = transistor:*-NPN-: NPN Transistror BF959 corrected 2008.03.06
R1-R80 R83 R84 = rcl:R-US_: RESISTOR, American symbol
R81 R82 = dec-con:275P: Trimpot with 275P (3006Y) footprint.
U$1 = dec-con:OUTLINE-*: Board outlines for DEC boards.
U$2 = dec-con:QUAD: Quad-Height DEC board